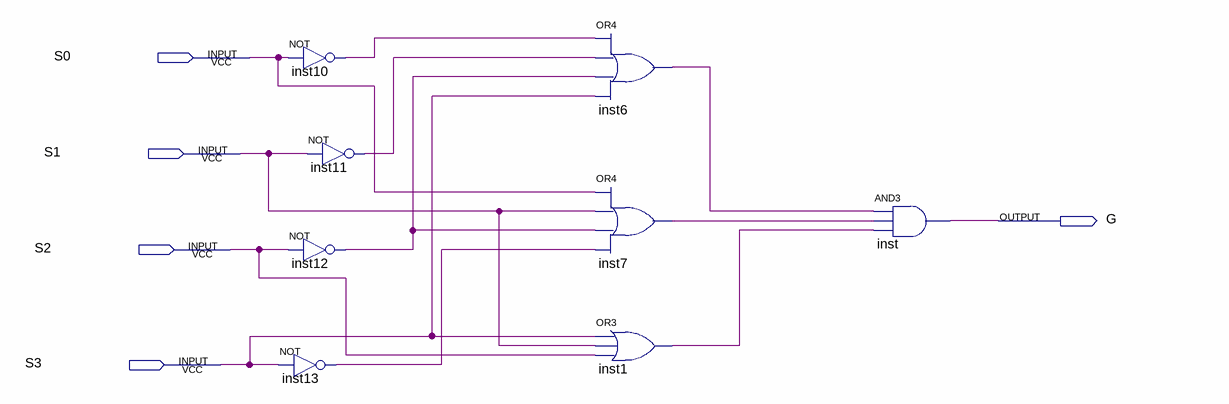
[diagram p0: schematic sheet]
// Quartus schematic G-nda2_3.bdf as structural Verilog: 8 symbols, 5 pins
module \G-nda2_3  (
  input  S0,
  input  S1,
  input  S2,
  input  S3,
  output G
);

  wire inst1_out, inst6_out, inst7_out, inst10_out, inst11_out, inst12_out, inst13_out;

  not inst10 (inst10_out, S0);
  not inst11 (inst11_out, S1);
  not inst12 (inst12_out, S2);
  not inst13 (inst13_out, S3);
  or inst6 (inst6_out, inst10_out, inst11_out, inst12_out, S3);
  or inst7 (inst7_out, S0, S1, inst12_out, inst13_out);
  or inst1 (inst1_out, S3, S1, S2);
  and inst (G, inst6_out, inst7_out, inst1_out);
endmodule
